# Altium schematic sheet NB680.SchDoc
size A4; SheetNumber: 4; SheetTotal: 16
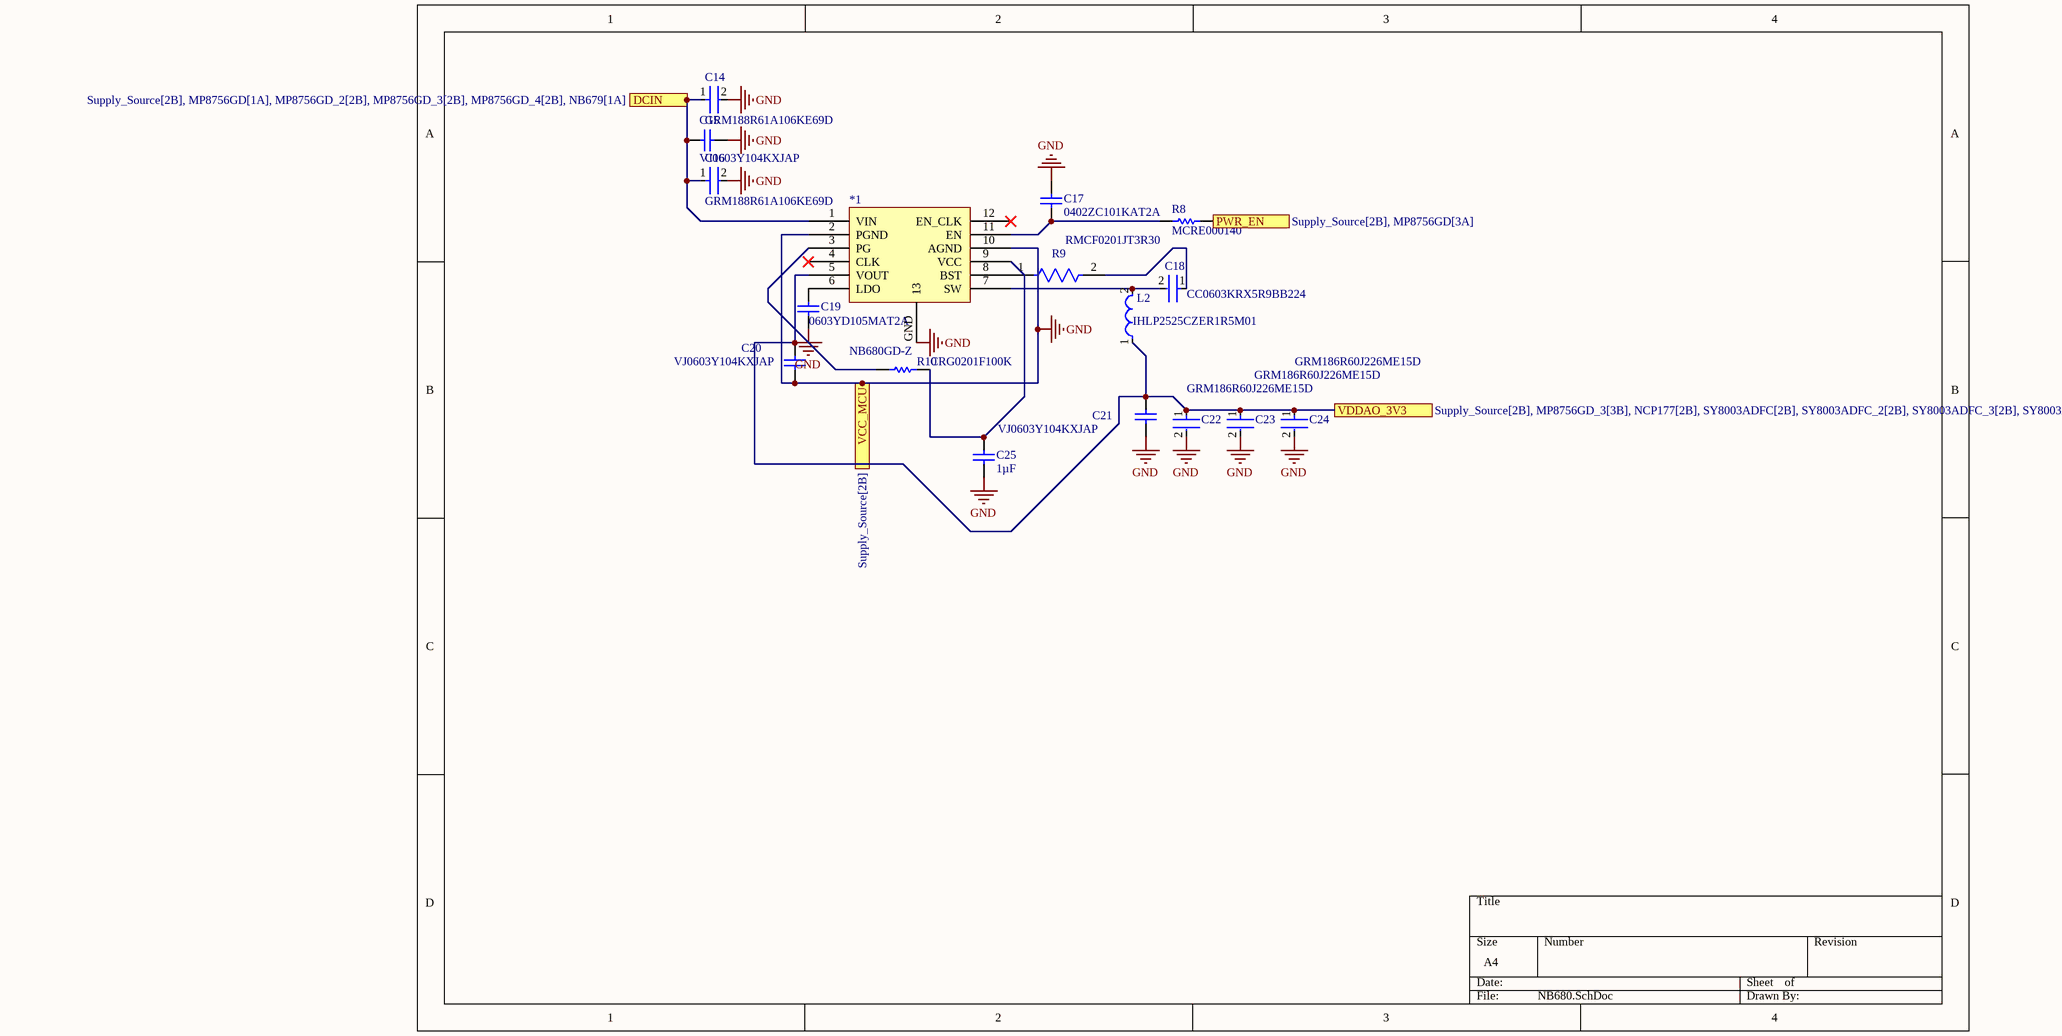
[diagram p0: NB680.SchDoc]

## Parts
*1  NB680GD-Z  [NB680GD-Z-Footprint-1]
C14  GRM188R61A106KE69D  [FP-GRM18-0_15-MFG]
C15  VJ0603Y104KXJAP  [CAPC1608X92X38NL15T08]
C16  GRM188R61A106KE69D  [FP-GRM18-0_15-MFG]
C17  0402ZC101KAT2A  [CAPC1005X56X25NL10T15]
C18  CC0603KRX5R9BB224  [FP-CC0603-DA-MFG]
C19  0603YD105MAT2A  [CAPC1608X90X35NL15T15]
C20  VJ0603Y104KXJAP  [CAPC1608X92X38NL15T08]
C21  VJ0603Y104KXJAP  [CAPC1608X92X38NL15T08]
C22  GRM186R60J226ME15D  [FP-GRM186-0_2-IPC_B]
C23  GRM186R60J226ME15D  [FP-GRM186-0_2-IPC_B]
C24  GRM186R60J226ME15D  [FP-GRM186-0_2-IPC_B]
C25  value 1µF  [CAPC1608X90X35LL15T15]  (hidden comment: 0603YD105MAT2A)
L2  IHLP2525CZER1R5M01  [FP-IHLP-2525CZ-FP_2_413x3-MFG]
R8  MCRE000140  [RESC0603X26X15ML03T05]
R9  RMCF0201JT3R30  [FP-RMCF0201-IPC_A]
R10  CRG0201F100K  [RESC0603X26X15LL03T05]

## Ports
DCIN (see Supply_Source[2B], MP8756GD[1A], MP8756GD_2[2B], MP8756GD_3[2B], MP8756GD_4[2B], NB679[1A]), PWR_EN (see Supply_Source[2B], MP8756GD[3A]), VCC_MCU (see Supply_Source[2B]), VDDAO_3V3 (see Supply_Source[2B], MP8756GD_3[3B], NCP177[2B], SY8003ADFC[2B], SY8003ADFC_2[2B], SY8003ADFC_3[2B], SY8003ADFC_4[2C], TLV76701[1B])

## Nets
GND: *1.2(PGND) *1.10(AGND) *1.GND(13) C14.2 C15.1 C16.2 C17.1 C19.2 C20.1 C21.1 C22.2 C23.2 C24.2 C25.1 ; port VCC_MCU
DCIN: *1.1(VIN) C14.1 C15.2 C16.1 ; port DCIN
PWR_EN: R8.2 ; port PWR_EN
VDDAO_3V3: *1.5(VOUT) C20.2 C21.2 C22.1 C23.1 C24.1 L2.1 ; port VDDAO_3V3
Net*1_3: *1.3(PG) R10.1
Net*1_6: *1.6(LDO) C19.1
Net*1_7: *1.7(SW) C18.2 L2.2
Net*1_8: *1.8(BST) R9.1
Net*1_9: *1.9(VCC) C25.2 R10.2
Net*1_11: *1.11(EN) C17.2 R8.1
NetC18_1: C18.1 R9.2

Not connected (* = marked no-connect by the designer): *1 4(CLK)* 12(EN_CLK)*

## Library data of the parts
*1 = CMP-019-00054-1: Wide Vin 4.8-26V Low Iq High Current Fixed 3.3V-8A Synchronous Buck Converter with 100mA LDO; Max Supply Voltage: 24V; Max Operating Temperature: 125°C; Min Operating Temperature: -40°C
C14 C16 = CMP-2000-05448-2: CAP CER 10UF 10V X5R 0603; Manufacturer: Murata; Temperature Coefficient: 15%; Material: Ceramic; Tolerance: 10%; Device Class L1: Passive Components; ComponentLink2Description: Datasheet; Height: 0.95mm; Package: GRM18-0.15; Octopart: https://octopart.com/grm188r61a106ke69d-murata-22851381; Manufacturer Part Number: GRM188R61A106KE69D; Value: 10uF; Digikey Description: CAP CER 10UF 10V X5R 0603; Temperature Range High: +85°C; Temperature Range Low: -55°C; Temperature Characteristic: X5R; Capacitance: 10uF; RoHS: TRUE; Device Class L2: Capacitors; ComponentLink2URL: https://search.murata.co.jp/Ceramy/image/img/A01X/G101/ENG/GRM188R61A106KE69-01A.pdf; Device Class L3: Ceramic Capacitors; Lead Free: Yes; Mouser Description: Multilayer Ceramic Capacitors MLCC - SMD/SMT 0603 10uF 10volts X5R + - 10%; Category: Cap; Voltage Rating: 10V; Temperature: -55°C to +85°C; Automotive: No
C15 C20 C21 = CMP-2006-01211-1: Manufacturer: Vitramon; Part Number: VJ0603Y104KXJAP
C17 = CMP-2008-02938-1: Manufacturer: AVX Interconnect / Elco; Part Number: 0402ZC101KAT2A
C18 = CMP-03422-000839-1: CC0603 220 nF X5R 10.00% 50 V; Manufacturer: YAGEO; Tolerance: 0.1; Capacitance: 220 nF; Temperature Coefficient: 15%; Material: Ceramic; Voltage Rating: 50 V; Value: 220 nF; Package: CC0603-DA; Temperature: -55°C to +125°C; Automotive: No; ComponentLink2URL: http://www.yageo.com/documents/recent/UPY-GPHC_X7R_6.3V-to-50V_18.pdf; Device Class L1: Passive Components; Footprint Url: http://www.yageo.com/exep/pages/download/literatures/UPY-C_GEN_24.pdf; Mouser Description: Surface Mount Ceramic Multilayer Capacitor 0.22uF 10% X5R 50V 0603 Paper T/R; Temperature Range Low: -55°C; ComponentLink2Description: Datasheet; Temperature Characteristic: X5R; Category: Cap; Octopart: https://octopart.com/cc0603krx5r9bb224-yageo-90326743; Device Class L3: Ceramic Capacitors; RoHS: TRUE; Device Class L2: Capacitors; Height: 0.9mm; Manufacturer Part Number: CC0603KRX5R9BB224; Temperature Range High: +125°C; Voltage: 50 V; Lead Free: Yes
C19 = CMP-2006-04534-1: Manufacturer: AVX Interconnect / Elco; Part Number: 0603YD105MAT2A
C22-C24 = CMP-06035-038491-1: Chip Multilayer Ceramic Capacitors for General Purpose, 0603, 22uF, X5R, 15%, 20%, 6.3V; Mount: Surface Mount; Thickness: 0.028inch; Tolerance: 20%; Width: 0.031inch; Voltage Rating (DC): 6.3V; Min Operating Temperature: -55°C; Voltage Rating: 6.3V; Capacitance: 22uF; Dielectric: X5R; Case Code (Imperial): 0603; Length: 0.063inch; Case/Package: 0603; Packaging: Tape and Reel; Case Code (Metric): 1608; Max Operating Temperature: 85°C
C25 = CMP-001-00098-1: 0603 1 uF 16 V ±20 % Tolerance X5R Surface Mount Multilayer Ceramic Capacitor; Tolerance: 20%; Voltage Rating: 16V; Min Operating Temperature: -55°C; Mounting Technology: Surface Mount; Case/Package: 0603; Max Operating Temperature: 85°C; Pins: 2
L2 = CMP-2000-06441-2: Commercial Inductors, High Saturation Series 1.5uH 9A 15mΩ 20%; DC Resistance (DCR): 15mR; Shielding: Shielded; Self Resonant Frequency: 5MHz; Max DC Current: 18A; Test Frequency: 100kHz; Core Material: Metal; Packaging: Tape and Reel; RMS Current (Irms): 9A; Length: 7.24mm; Case Code (Imperial): 2525; Case/Package: 2525; Min Operating Temperature: -55°C; Number of Pins: 2; Contact Plating: Tin; Height: 3mm; Height - Seated (Max): 0.118inch; Termination: SMD/SMT; Max Operating Temperature: 125°C; Depth: 6.72mm; Width: 6.47mm; Current Rating: 9A; Tolerance: 20%; Lead Free: Lead Free; Military Standard: Not; Radiation Hardening: No; Saturation Current: 18A; Package Quantity: 2000; Inductance Tolerance: 20%; Inductance: 1.5uH; Mount: Surface Mount
R8 = CMP-2004-02508-1: Manufacturer: Multicomp; Part Number: MCRE000140
R9 = CMP-26527-006332-1: 3.3Ω ±5% 0.05W 0201 Thick Film Chip Resistor AEC-Q200 compliant; Temperature Coefficient: 400ppm/°C; Resistance: 3.3R; Max Power Dissipation: 50mW; Mount: Surface Mount; Resistor Type: Thick Film; Series: RMCF; Tolerance: 5%; Contact Plating: Tin; Max Operating Temperature: 125°C; Radiation Hardening: No; Min Operating Temperature: -55°C; Height: 0.009inch; Number of Terminations: 2; Packaging: Tape and Reel; RoHS Compliant: Yes; Length: 0.024inch; Width: 0.012inch; Case/Package: 0201
R10 = CMP-2004-03564-1: Manufacturer: TE Connectivity / AMP; Part Number: CRG0201F100K